# EAGLE design guhPLC_dimmModule_V0.1 (EAGLE 6.1)
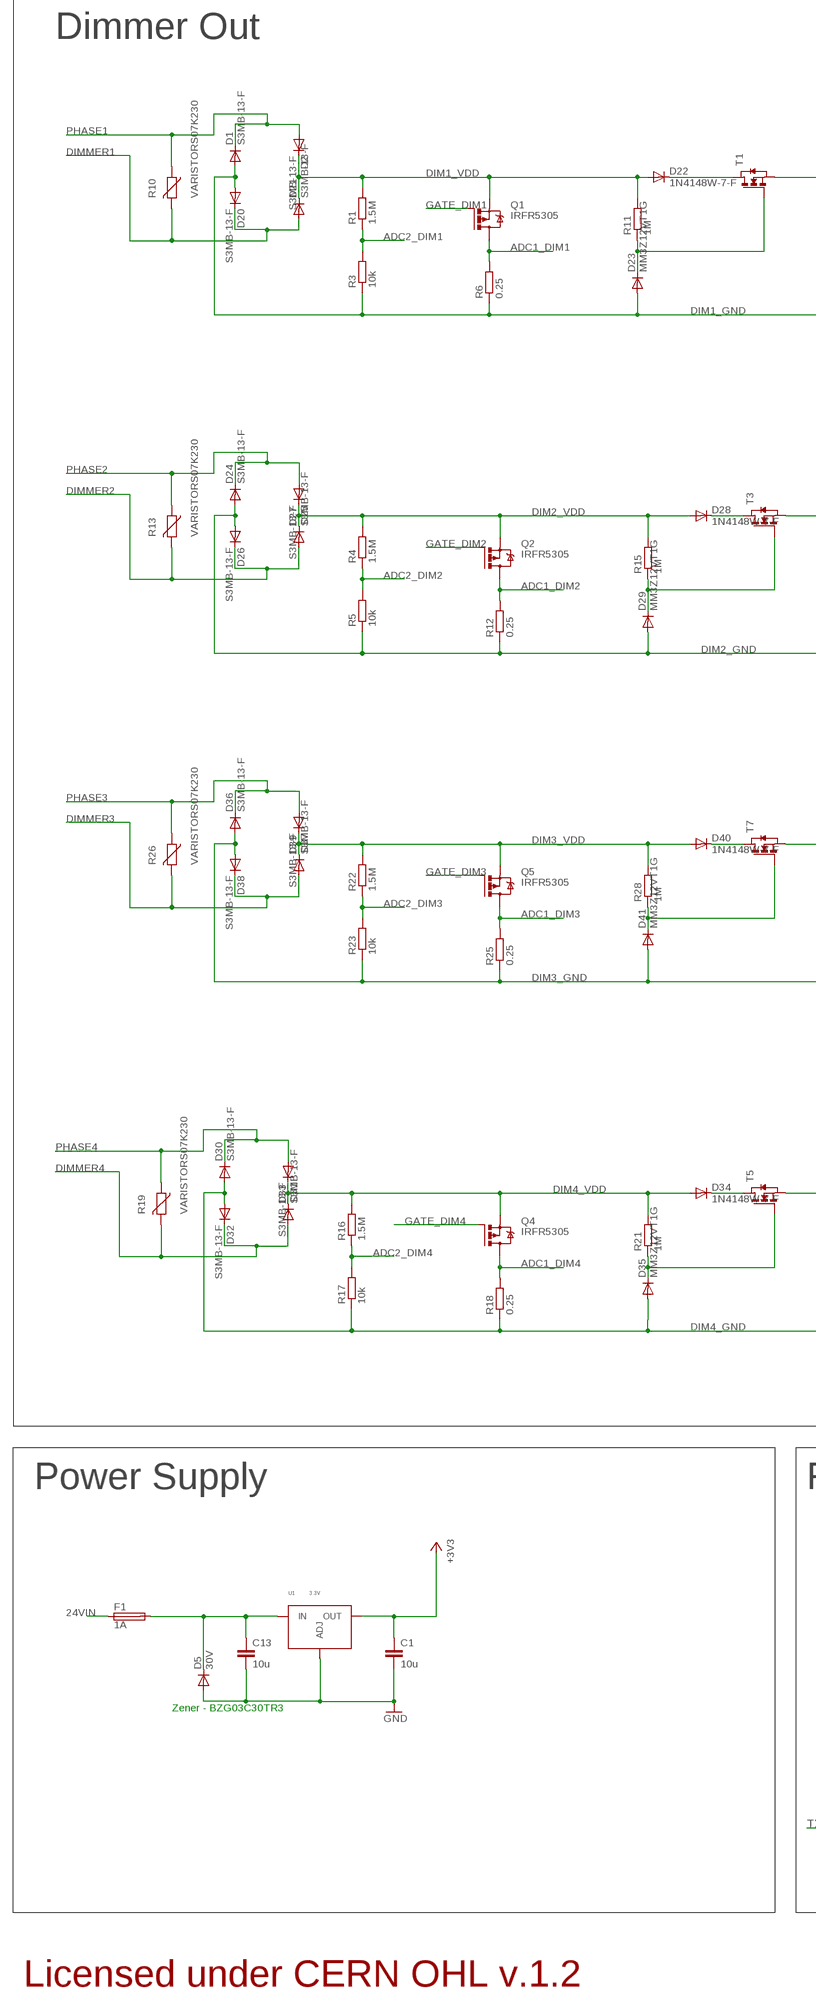
[diagram p0: schematic, sheet 1, part 1 of 2]
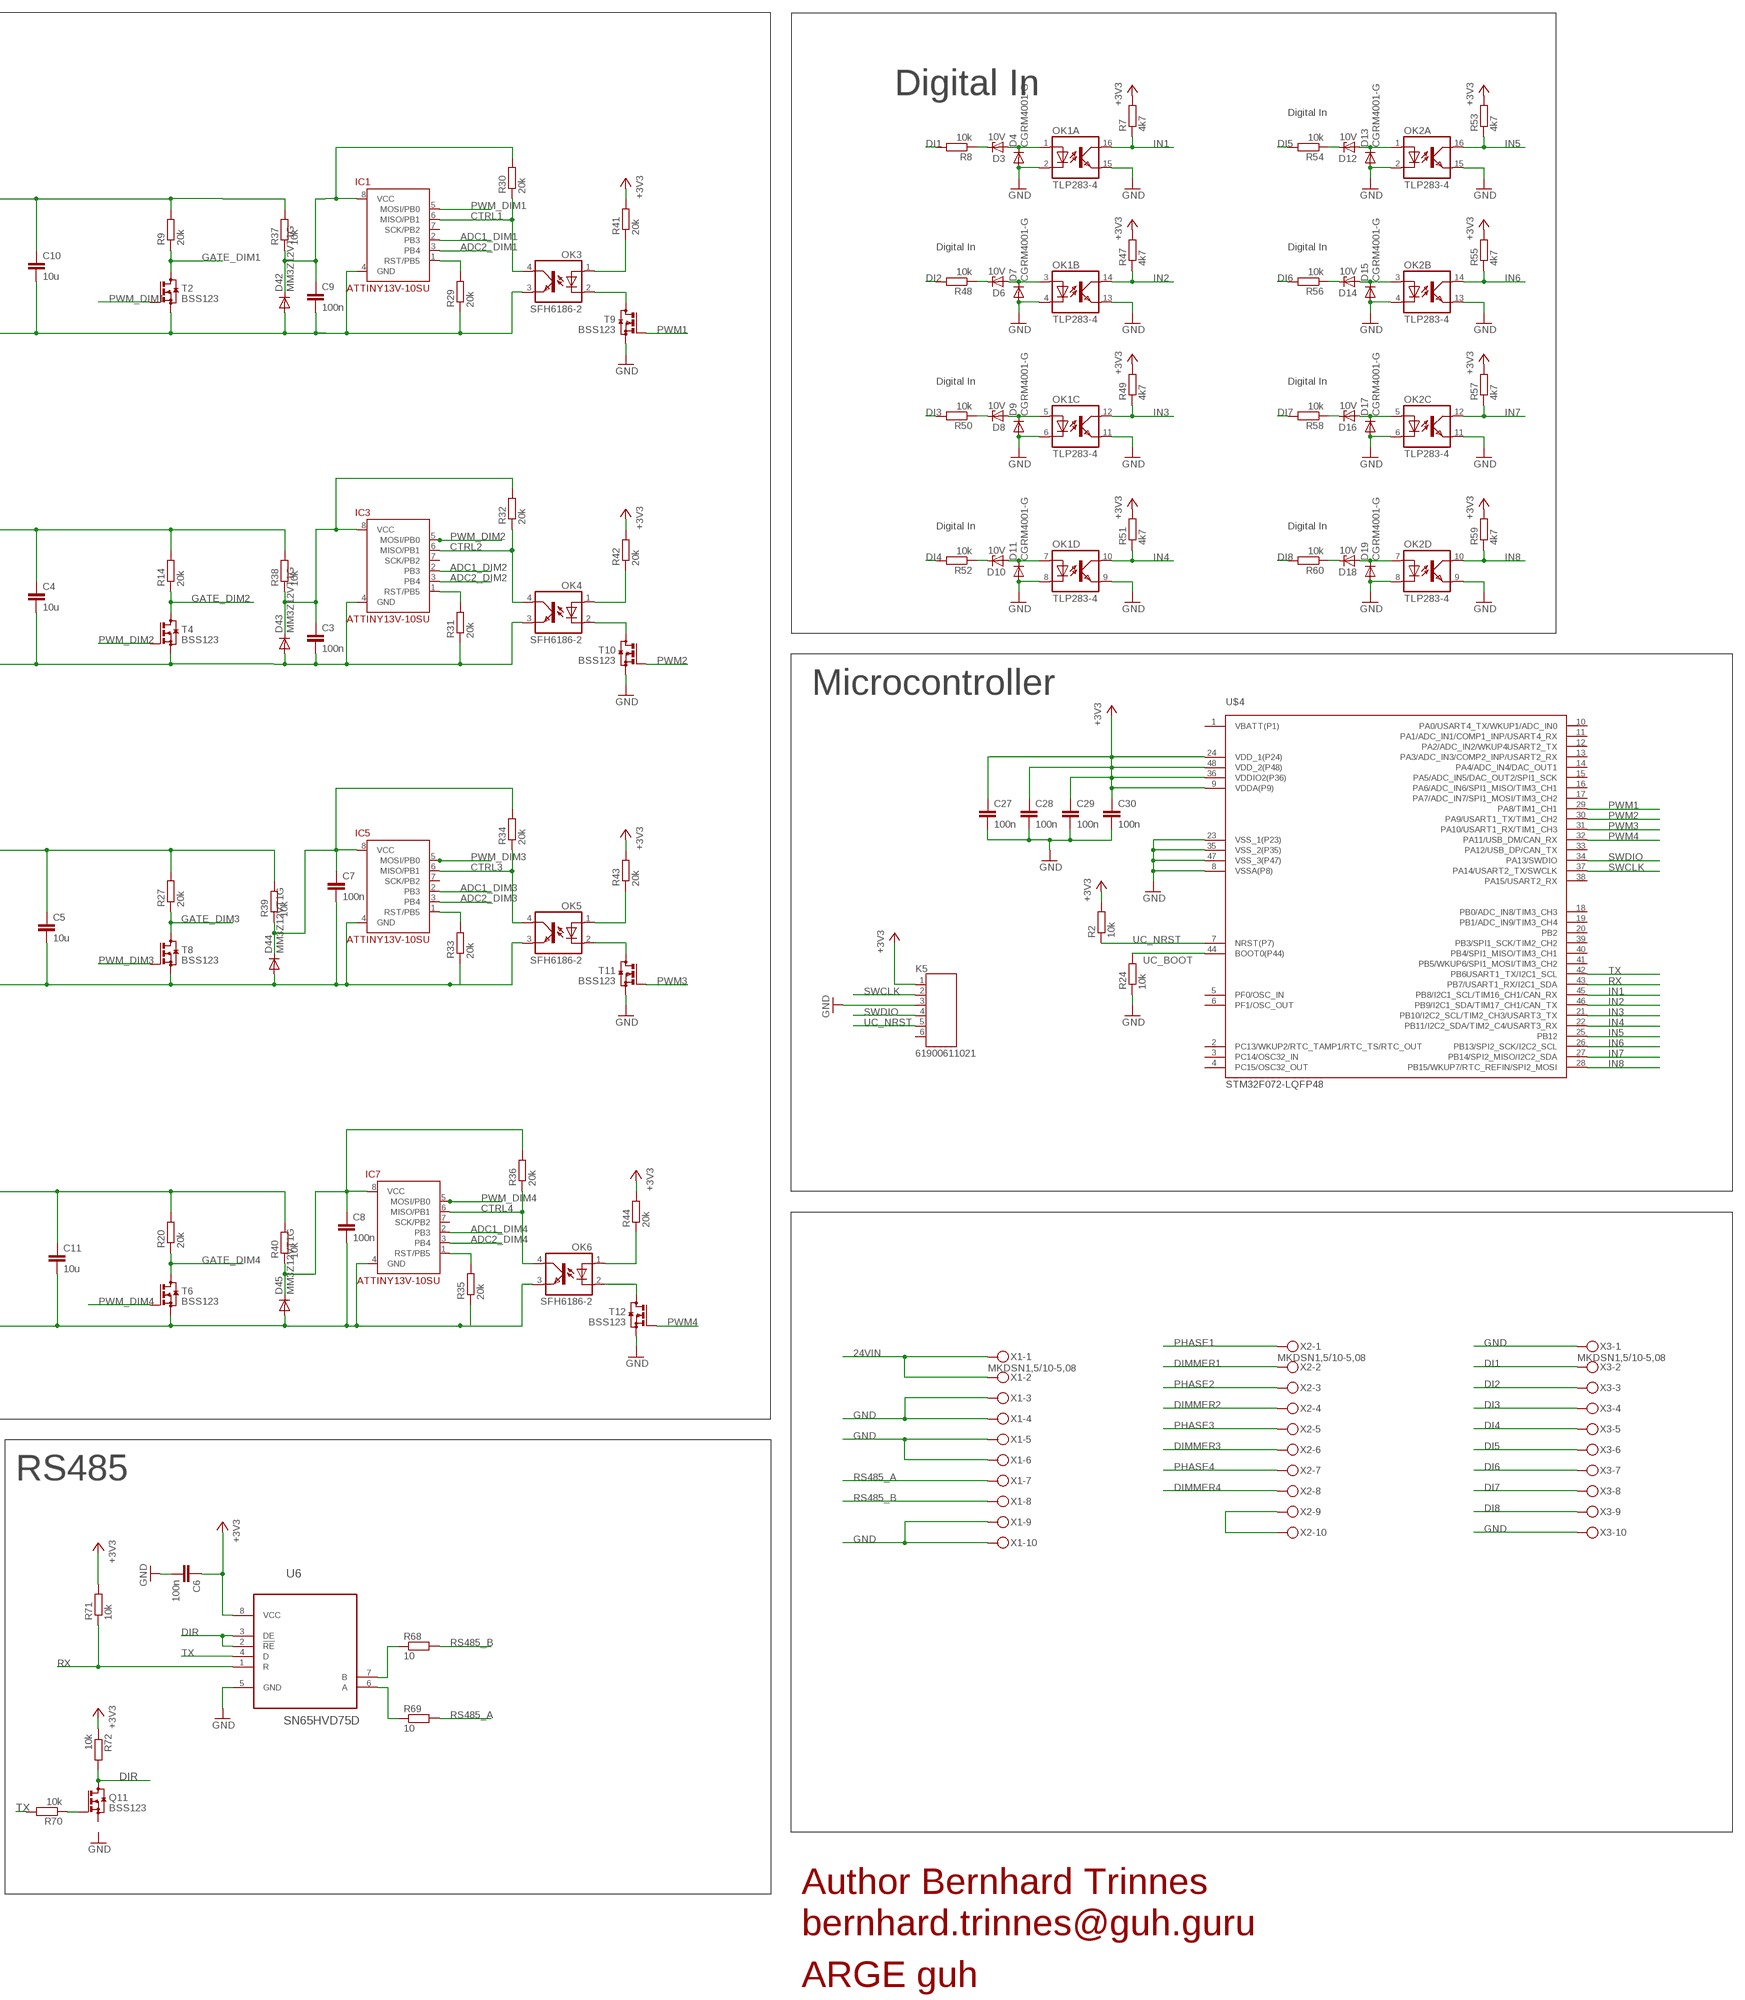
[diagram p1: schematic, sheet 1, part 2 of 2]

## Parts
C1  10u  C-EUC1206  [C1206]
C3  100n  C-EUC0603  [C0603]
C4  10u  C-EUC1206  [C1206]
C5  10u  C-EUC1206  [C1206]
C6  100n  C-EUC1206  [C1206]
C7  100n  C-EUC0603  [C0603]
C8  100n  C-EUC0603  [C0603]
C9  100n  C-EUC0603  [C0603]
C10  10u  C-EUC1206  [C1206]
C11  10u  C-EUC1206  [C1206]
C13  10u  C-EUC1206  [C1206]
C27  100n  C-EUC0603  [C0603]
C28  100n  C-EUC0603  [C0603]
C29  100n  C-EUC0603  [C0603]
C30  100n  C-EUC0603  [C0603]
D1  S3MB-13-F  DIODE-DO214AA  [DO214AA]
D2  S3MB-13-F  DIODE-DO214AA  [DO214AA]
D3  10V  ZENER-DIODESOD80C  [SOD80C]
D4  CGRM4001-G  [SOD-123_MINI-SMA]
D5  30V  DIODE-DO214AC  [DO214AC]
D6  10V  ZENER-DIODESOD80C  [SOD80C]
D7  CGRM4001-G  [SOD-123_MINI-SMA]
D8  10V  ZENER-DIODESOD80C  [SOD80C]
D9  CGRM4001-G  [SOD-123_MINI-SMA]
D10  10V  ZENER-DIODESOD80C  [SOD80C]
D11  CGRM4001-G  [SOD-123_MINI-SMA]
D12  10V  ZENER-DIODESOD80C  [SOD80C]
D13  CGRM4001-G  [SOD-123_MINI-SMA]
D14  10V  ZENER-DIODESOD80C  [SOD80C]
D15  CGRM4001-G  [SOD-123_MINI-SMA]
D16  10V  ZENER-DIODESOD80C  [SOD80C]
D17  CGRM4001-G  [SOD-123_MINI-SMA]
D18  10V  ZENER-DIODESOD80C  [SOD80C]
D19  CGRM4001-G  [SOD-123_MINI-SMA]
D20  S3MB-13-F  DIODE-DO214AA  [DO214AA]
D21  S3MB-13-F  DIODE-DO214AA  [DO214AA]
D22  1N4148W-7-F  DIODE-SOD123  [SOD123]
D23  MM3Z12VT1G  DIODE-SOD323-W  [SOD323-W]
D24  S3MB-13-F  DIODE-DO214AA  [DO214AA]
D25  S3MB-13-F  DIODE-DO214AA  [DO214AA]
D26  S3MB-13-F  DIODE-DO214AA  [DO214AA]
D27  S3MB-13-F  DIODE-DO214AA  [DO214AA]
D28  1N4148W-7-F  DIODE-SOD123  [SOD123]
D29  MM3Z12VT1G  DIODE-SOD323-W  [SOD323-W]
D30  S3MB-13-F  DIODE-DO214AA  [DO214AA]
D31  S3MB-13-F  DIODE-DO214AA  [DO214AA]
D32  S3MB-13-F  DIODE-DO214AA  [DO214AA]
D33  S3MB-13-F  DIODE-DO214AA  [DO214AA]
D34  1N4148W-7-F  DIODE-SOD123  [SOD123]
D35  MM3Z12VT1G  DIODE-SOD323-W  [SOD323-W]
D36  S3MB-13-F  DIODE-DO214AA  [DO214AA]
D37  S3MB-13-F  DIODE-DO214AA  [DO214AA]
D38  S3MB-13-F  DIODE-DO214AA  [DO214AA]
D39  S3MB-13-F  DIODE-DO214AA  [DO214AA]
D40  1N4148W-7-F  DIODE-SOD123  [SOD123]
D41  MM3Z12VT1G  DIODE-SOD323-W  [SOD323-W]
D42  MM3Z12VT1G  DIODE-SOD323-W  [SOD323-W]
D43  MM3Z12VT1G  DIODE-SOD323-W  [SOD323-W]
D44  MM3Z12VT1G  DIODE-SOD323-W  [SOD323-W]
D45  MM3Z12VT1G  DIODE-SOD323-W  [SOD323-W]
F1  1A  LITTLEFUSE  [LITTLEFUSE]
IC1  ATTINY13V-10SU  [SOIC8]
IC3  ATTINY13V-10SU  [SOIC8]
IC5  ATTINY13V-10SU  [SOIC8]
IC7  ATTINY13V-10SU  [SOIC8]
K5  61900611021  [61900611021]
OK1  TLP283-4  [MINI-FLAT-16]
OK2  TLP283-4  [MINI-FLAT-16]
OK3  SFH6186-2  [SMD4]
OK4  SFH6186-2  [SMD4]
OK5  SFH6186-2  [SMD4]
OK6  SFH6186-2  [SMD4]
Q1  IRFR5305  [D-PAK_TO252AA]
Q2  IRFR5305  [D-PAK_TO252AA]
Q4  IRFR5305  [D-PAK_TO252AA]
Q5  IRFR5305  [D-PAK_TO252AA]
Q11  BSS123  [SOT23]
R1  1.5M  R-EU_R1206  [R1206]
R2  10k  R-EU_R0603  [R0603]
R3  10k  R-EU_R1206  [R1206]
R4  1.5M  R-EU_M1206  [M1206]
R5  10k  R-EU_M1206  [M1206]
R6  0.25  R-EU_R1206  [R1206]
R7  4k7  R-EU_R0603  [R0603]
R8  10k  R-EU_R0805  [R0805]
R9  20k  R-EU_M1206  [M1206]
R10  VARISTORS07K230  [S07K230]
R11  1M  R-EU_R1206  [R1206]
R12  0.25  R-EU_M1206  [M1206]
R13  VARISTORS07K230  [S07K230]
R14  20k  R-EU_M1206  [M1206]
R15  1M  R-EU_M1206  [M1206]
R16  1.5M  R-EU_M1206  [M1206]
R17  10k  R-EU_M1206  [M1206]
R18  0.25  R-EU_M1206  [M1206]
R19  VARISTORS07K230  [S07K230]
R20  20k  R-EU_M1206  [M1206]
R21  1M  R-EU_M1206  [M1206]
R22  1.5M  R-EU_M1206  [M1206]
R23  10k  R-EU_M1206  [M1206]
R24  10k  R-EU_R0603  [R0603]
R25  0.25  R-EU_M1206  [M1206]
R26  VARISTORS07K230  [S07K230]
R27  20k  R-EU_M1206  [M1206]
R28  1M  R-EU_M1206  [M1206]
R29  20k  R-EU_R0603  [R0603]
R30  20k  R-EU_R0603  [R0603]
R31  20k  R-EU_R0603  [R0603]
R32  20k  R-EU_R0603  [R0603]
R33  20k  R-EU_R0603  [R0603]
R34  20k  R-EU_R0603  [R0603]
R35  20k  R-EU_R0603  [R0603]
R36  20k  R-EU_R0603  [R0603]
R37  10k  R-EU_M1206  [M1206]
R38  10k  R-EU_M1206  [M1206]
R39  10k  R-EU_M1206  [M1206]
R40  10k  R-EU_M1206  [M1206]
R41  20k  R-EU_R0603  [R0603]
R42  20k  R-EU_R0603  [R0603]
R43  20k  R-EU_R0603  [R0603]
R44  20k  R-EU_R0603  [R0603]
R47  4k7  R-EU_R0603  [R0603]
R48  10k  R-EU_R0805  [R0805]
R49  4k7  R-EU_R0603  [R0603]
R50  10k  R-EU_R0805  [R0805]
R51  4k7  R-EU_R0603  [R0603]
R52  10k  R-EU_R0805  [R0805]
R53  4k7  R-EU_R0603  [R0603]
R54  10k  R-EU_R0805  [R0805]
R55  4k7  R-EU_R0603  [R0603]
R56  10k  R-EU_R0805  [R0805]
R57  4k7  R-EU_R0603  [R0603]
R58  10k  R-EU_R0805  [R0805]
R59  4k7  R-EU_R0603  [R0603]
R60  10k  R-EU_R0805  [R0805]
R68  10  R-EU_R0603  [R0603]
R69  10  R-EU_R0603  [R0603]
R70  10k  R-EU_R0603  [R0603]
R71  10k  R-EU_R0603  [R0603]
R72  10k  R-EU_R0603  [R0603]
T1  NMOSSOT23  [SOT-23]
T2  BSS123  [SOT23]
T3  NMOSSOT23  [SOT-23]
T4  BSS123  [SOT23]
T5  NMOSSOT23  [SOT-23]
T6  BSS123  [SOT23]
T7  NMOSSOT23  [SOT-23]
T8  BSS123  [SOT23]
T9  BSS123  [SOT23]
T10  BSS123  [SOT23]
T11  BSS123  [SOT23]
T12  BSS123  [SOT23]
U1  3.3V  ADJ_VOLTAGE_REGTO-252-3L  [TO-252-3L]
U6  SN65HVD75D  [SOIC127P600X175-8N]
U$4  STM32F072-LQFP48  [LQFP48]
X1  MKDSN1,5/10-5,08  [MKDSN1,5/10-5,08]
X2  MKDSN1,5/10-5,08  [MKDSN1,5/10-5,08]
X3  MKDSN1,5/10-5,08  [MKDSN1,5/10-5,08]

## Nets
24VIN: F1.1 X1.1 X1.2
+3V3: C1.1 C6.1 C27.1 C28.1 C29.1 C30.1 K5.1 R2.2 R7.2 R41.2 R42.2 R43.2 R44.2 R47.2 R49.2 R51.2 R53.2 R55.2 R57.2 R59.2 R71.2 R72.1 U1.PAD(OUT) U6.8(VCC) U$4.9(VDDA(P9)) U$4.24(VDD_1(P24)) U$4.36(VDDIO2(P36)) U$4.48(VDD_2(P48))
ADC1_DIM1: IC1.2(PB3) Q1.4(D) R6.2
ADC1_DIM2: IC3.2(PB3) Q2.4(D) R12.2
ADC1_DIM3: IC5.2(PB3) Q5.4(D) R25.2
ADC1_DIM4: IC7.2(PB3) Q4.4(D) R18.2
ADC2_DIM1: IC1.3(PB4) R1.1 R3.2
ADC2_DIM2: IC3.3(PB4) R4.1 R5.2
ADC2_DIM3: IC5.3(PB4) R22.1 R23.2
ADC2_DIM4: IC7.3(PB4) R16.1 R17.2
CTRL1: IC1.6(MISO/PB1) OK3.4(COL) R30.1
CTRL2: IC3.6(MISO/PB1) OK4.4(COL) R32.1
CTRL3: IC5.6(MISO/PB1) OK5.4(COL) R34.1
CTRL4: IC7.6(MISO/PB1) OK6.4(COL) R36.1
DI1: R8.2 X3.2
DI2: R48.2 X3.3
DI3: R50.2 X3.4
DI4: R52.2 X3.5
DI5: R54.2 X3.6
DI6: R56.2 X3.7
DI7: R58.2 X3.8
DI8: R60.2 X3.9
DIM1_GND [gnd]: C9.2 C10.2 D1.A D20.A D23.A D42.A IC1.4(GND) OK3.3(EMIT) R3.1 R6.1 R29.1 T2.2(S)
DIM1_VDD: D2.C D21.C D22.A Q1.3(S) R1.2 R11.2
DIM2_GND [gnd]: C3.2 C4.2 D24.A D26.A D29.A D43.A IC3.4(GND) OK4.3(EMIT) R5.1 R12.1 R31.1 T4.2(S)
DIM2_VDD: D25.C D27.C D28.A Q2.3(S) R4.2 R15.2
DIM3_GND [gnd]: C5.2 C7.2 D36.A D38.A D41.A D44.A IC5.4(GND) OK5.3(EMIT) R23.1 R25.1 R33.1 T8.2(S)
DIM3_VDD: D37.C D39.C D40.A Q5.3(S) R22.2 R28.2
DIM4_GND [gnd]: C8.2 C11.2 D30.A D32.A D35.A D45.A IC7.4(GND) OK6.3(EMIT) R17.1 R18.1 R35.1 T6.2(S)
DIM4_VDD: D31.C D33.C D34.A Q4.3(S) R16.2 R21.2
DIMMER1: D20.C D21.A R10.2 X2.2
DIMMER2: D26.C D27.A R13.2 X2.4
DIMMER3: D38.C D39.A R26.2 X2.6
DIMMER4: D32.C D33.A R19.2 X2.8
DIR: Q11.3(D) R72.2 U6.2(!RE) U6.3(DE)
GATE_DIM1: Q1.1(G) R9.1 T2.3(D)
GATE_DIM2: Q2.1(G) R14.1 T4.3(D)
GATE_DIM3: Q5.1(G) R27.1 T8.3(D)
GATE_DIM4: Q4.1(G) R20.1 T6.3(D)
GND [gnd]: C1.2 C6.2 C13.2 C27.2 C28.2 C29.2 C30.2 D4.A D5.A D7.A D9.A D11.A D13.A D15.A D17.A D19.A K5.3 OK1.2(A:C) OK1.4(B:C) OK1.6(C:C) OK1.8(D:C) OK1.9(D:EMIT) OK1.11(C:EMIT) OK1.13(B:EMIT) OK1.15(A:EMIT) OK2.2(A:C) OK2.4(B:C) OK2.6(C:C) OK2.8(D:C) OK2.9(D:EMIT) OK2.11(C:EMIT) OK2.13(B:EMIT) OK2.15(A:EMIT) R24.1 T9.2(S) T10.2(S) T11.2(S) T12.2(S) U1.1(ADJ) U6.5(GND) U$4.8(VSSA(P8)) U$4.23(VSS_1(P23)) U$4.35(VSS_2(P35)) U$4.47(VSS_3(P47)) X1.3 X1.4 X1.5 X1.6 X1.9 X1.10 X3.1 X3.10
IN1: OK1.16(A:COL) R7.1 U$4.45(PB8/I2C1_SCL/TIM16_CH1/CAN_RX)
IN2: OK1.14(B:COL) R47.1 U$4.46(PB9/I2C1_SDA/TIM17_CH1/CAN_TX)
IN3: OK1.12(C:COL) R49.1 U$4.21(PB10/I2C2_SCL/TIM2_CH3/USART3_TX)
IN4: OK1.10(D:COL) R51.1 U$4.22(PB11/I2C2_SDA/TIM2_C4/USART3_RX)
IN5: OK2.16(A:COL) R53.1 U$4.25(PB12)
IN6: OK2.14(B:COL) R55.1 U$4.26(PB13/SPI2_SCK/I2C2_SCL)
IN7: OK2.12(C:COL) R57.1 U$4.27(PB14/SPI2_MISO/I2C2_SDA)
IN8: OK2.10(D:COL) R59.1 U$4.28(PB15/WKUP7/RTC_REFIN/SPI2_MOSI)
N$1 [power]: C8.1 D45.C IC7.8(VCC) R36.2 R40.1
N$2: D29.C R15.1 T3.3(G)
N$3: D28.C T3.1(D)
N$4: D22.C T1.1(D)
N$5: D23.C R11.1 T1.3(G)
N$6 [power]: C9.1 D42.C IC1.8(VCC) R30.2 R37.1
N$7 [power]: C3.1 D43.C IC3.8(VCC) R32.2 R38.1
N$8: D3.C R8.1
N$9: D35.C R21.1 T5.3(G)
N$10: D3.A D4.C OK1.1(A:A)
N$11: D34.C T5.1(D)
N$12 [power]: C7.1 D44.C IC5.8(VCC) R34.2 R39.1
N$13: D41.C R28.1 T7.3(G)
N$14: D40.C T7.1(D)
N$15: C10.1 R9.2 R37.2 T1.2(S)
N$16: OK3.1(A) R41.1
N$17: C4.1 R14.2 R38.2 T3.2(S)
N$18: OK3.2(C) T9.3(D)
N$19: OK4.1(A) R42.1
N$20: C5.1 R27.2 R39.2 T7.2(S)
N$21: D6.C R48.1
N$22: OK4.2(C) T10.3(D)
N$23: D6.A D7.C OK1.3(B:A)
N$24: OK5.1(A) R43.1
N$25: C11.1 R20.2 R40.2 T5.2(S)
N$26: IC5.1(RST/PB5) R33.2
N$27: OK5.2(C) T11.3(D)
N$28: OK6.1(A) R44.1
N$29: OK6.2(C) T12.3(D)
N$30: X2.9 X2.10
N$33: IC1.1(RST/PB5) R29.2
N$34: IC3.1(RST/PB5) R31.2
N$35: IC7.1(RST/PB5) R35.2
N$38: D8.C R50.1
N$39: D8.A D9.C OK1.5(C:A)
N$40: D10.C R52.1
N$41: D10.A D11.C OK1.7(D:A)
N$42: D12.C R54.1
N$45: D12.A D13.C OK2.1(A:A)
N$47: D14.C R56.1
N$49: D14.A D15.C OK2.3(B:A)
N$51: D16.C R58.1
N$53: D16.A D17.C OK2.5(C:A)
N$54: D18.C R60.1
N$55: D18.A D19.C OK2.7(D:A)
N$63: R68.1 U6.7(B)
N$64: R69.1 U6.6(A)
N$65: Q11.1(G) R70.1
PHASE1: D1.C D2.A R10.1 X2.1
PHASE2: D24.C D25.A R13.1 X2.3
PHASE3: D36.C D37.A R26.1 X2.5
PHASE4: D30.C D31.A R19.1 X2.7
PWM1: T9.1(G) U$4.29(PA8/TIM1_CH1)
PWM2: T10.1(G) U$4.30(PA9/USART1_TX/TIM1_CH2)
PWM3: T11.1(G) U$4.31(PA10/USART1_RX/TIM1_CH3)
PWM4: T12.1(G) U$4.32(PA11/USB_DM/CAN_RX)
PWM_DIM1: IC1.5(MOSI/PB0) T2.1(G)
PWM_DIM2: IC3.5(MOSI/PB0) T4.1(G)
PWM_DIM3: IC5.5(MOSI/PB0) T8.1(G)
PWM_DIM4: IC7.5(MOSI/PB0) T6.1(G)
RS485_A: R69.2 X1.7
RS485_B: R68.2 X1.8
RX: R71.1 U6.1(R) U$4.43(PB7/USART1_RX/I2C1_SDA)
SWCLK: K5.2 U$4.37(PA14/USART2_TX/SWCLK)
SWDIO: K5.4 U$4.34(PA13/SWDIO)
TX: R70.2 U6.4(D) U$4.42(PB6USART1_TX/I2C1_SCL)
UC_BOOT: R24.2 U$4.44(BOOT0(P44))
UC_NRST: K5.5 R2.1 U$4.7(NRST(P7))
VCC [power]: C13.1 D5.C F1.2 U1.2(IN)
Unconnected: IC1.7(SCK/PB2) IC3.7(SCK/PB2) IC5.7(SCK/PB2) IC7.7(SCK/PB2) K5.6 Q11.2(S) U$4.1(VBATT(P1)) U$4.2(PC13/WKUP2/RTC_TAMP1/RTC_TS/RTC_OUT) U$4.3(PC14/OSC32_IN) U$4.4(PC15/OSC32_OUT) U$4.5(PF0/OSC_IN) U$4.6(PF1/OSC_OUT) U$4.10(PA0/USART4_TX/WKUP1/ADC_IN0) U$4.11(PA1/ADC_IN1/COMP1_INP/USART4_RX) U$4.12(PA2/ADC_IN2/WKUP4USART2_TX) U$4.13(PA3/ADC_IN3/COMP2_INP/USART2_RX) U$4.14(PA4/ADC_IN4/DAC_OUT1) U$4.15(PA5/ADC_IN5/DAC_OUT2/SPI1_SCK) U$4.16(PA6/ADC_IN6/SPI1_MISO/TIM3_CH1) U$4.17(PA7/ADC_IN7/SPI1_MOSI/TIM3_CH2) U$4.18(PB0/ADC_IN8/TIM3_CH3) U$4.19(PB1/ADC_IN9/TIM3_CH4) U$4.20(PB2) U$4.33(PA12/USB_DP/CAN_TX) U$4.38(PA15/USART2_RX) U$4.39(PB3/SPI1_SCK/TIM2_CH2) U$4.40(PB4/SPI1_MISO/TIM3_CH1) U$4.41(PB5/WKUP6/SPI1_MOSI/TIM3_CH2)

## Notes on the sheet
- Dimmer Out
- Digital In
- Digital In
- Digital In | Digital In
- Digital In | Digital In
- Digital In | Digital In
- Microcontroller
- Power Supply | RS485
- Zener - BZG03C30TR3
- Author Bernhard Trinnes
- bernhard.trinnes@guh.guru
- Licensed under CERN OHL v.1.2
- ARGE guh

## Library data of the parts
C1 C3-C11 C13 C27-C30 = resistor:C-EU: CAPACITOR, European symbol
D1 D2 D5 D20-D28 D30-D34 D36-D40 D42-D45 = diode:DIODE-: DIODE
D3 D6 D8 D10 D12 D14 D16 D18 = diode:ZENER-DIODE: Z-Diode
D4 D7 D9 D11 D13 D15 D17 D19 = diode:CGRM400*-G: Molded plasitc,JEDEC SOD-123/Mini SMA Source: Comchip CGRM4001-G.pdf
D29 D35 D41 = guh:DIODE-: DIODE
F1 = fuse:LITTLEFUSE: LITTLEFUSE Picofuse/slow Littlefuse; OC_FARNELL: unknown; OC_NEWARK: unknown
IC1 IC3 IC5 IC7 = attiny13:ATTINY13V-10*
K5 = EagleLibrary_Wuerth_Elektronik _eiCan_Wire_to_Board_Connectors_v6_20150113:61900611021: WR-WTB Wire-to-Board Connectors 2.54 mm - 6 Pins;=>Code : _61900611021 <http://katalog.we-online.de/media/images/eican/> Details see: http://katalog.we-online.de/em/datasheet/6190xx11021.pdf Created 11/27/2014, Karrer Zheng 2014 (C) Wurth Elektronik
OK1 OK2 = optocoupler:TLP283-4: TOSHIBA PHOTOCOUPLER GaAs IRED & PHOTO-TRANSISTOR Source: http://www.semicon.toshiba.co.jp/td/en/Opto/Photocoupler/en_20050928_TLP283_datasheet.pdf; OC_FARNELL: unknown; OC_NEWARK: unknown
OK3-OK6 = optocoupler:SFH618?*: Optocoupler, Phototransistor Output, Low Input Current Source: http://www.vishay.com/docs/83673/sfh618.pdf; MF: VISHAY/TELEFUNKEN; MPN: SFH6186-2; OC_FARNELL: 1469583; OC_NEWARK: 58K2210
Q1 Q2 Q4 Q5 = transistor-power:IRF?5305: HEXFET Power MOSFET Source: http://www.irf.com/product-info/datasheets/data/irfr5305pbf.pdf
Q11 T2 T4 T6 T8-T12 = transistor-small-signal:BSS123: N-CHANNEL MOS FET
R1-R9 R11 R12 R14-R18 R20-R25 R27-R44 R47-R60 R68-R72 = resistor:R-EU_: RESISTOR, European symbol
R10 R13 R19 R26 = varistor:VARISTOR: VARISTOR
T1 T3 T5 T7 = zetex:NMOSSOT23: MOS FET; OC_FARNELL: unknown; OC_NEWARK: unknown
U1 = PP_PowerIC:ADJ_VOLTAGE_REG
U6 = guh:SN65HVD75D: 3.3V-Supply RS-485 with IEC ESD Protection,SOIC-8; MPN: SN65HVD75D; OC_FARNELL: 2127163; OC_NEWARK: 94T1770; PACKAGE: SOIC- 8; SUPPLIER: TEXAS INSTRUMENTS
U$4 = stm32f0:STM32F072
X1-X3 = con-phoenix-508:MKDSN1,5/10-5,08: MKDSN 1,5/10-5,08 Printklemme Nennstrom: 13,5 A Nennspannung: 250 V Rastermaß: 5,08 mm Polzahl: 10 Anschlussart: Schraubanschluss Montage: Löten Anschlussrichtung Leiter/Platine: 0 ° Artikelnummer: 1729209 Source: http://eshop.phoenixcontact.com .. 1729209.pdf; MPN: SMKDSN1,5/10-5,08; OC_FARNELL: 1792913; OC_NEWARK: 70R0297

## Net classes
1 power: width 0.61 mm, drill 0.61 mm, clearance 0.254 mm
2 gnd: width 0.305 mm, drill 0.559 mm, clearance 0.254 mm

## Board
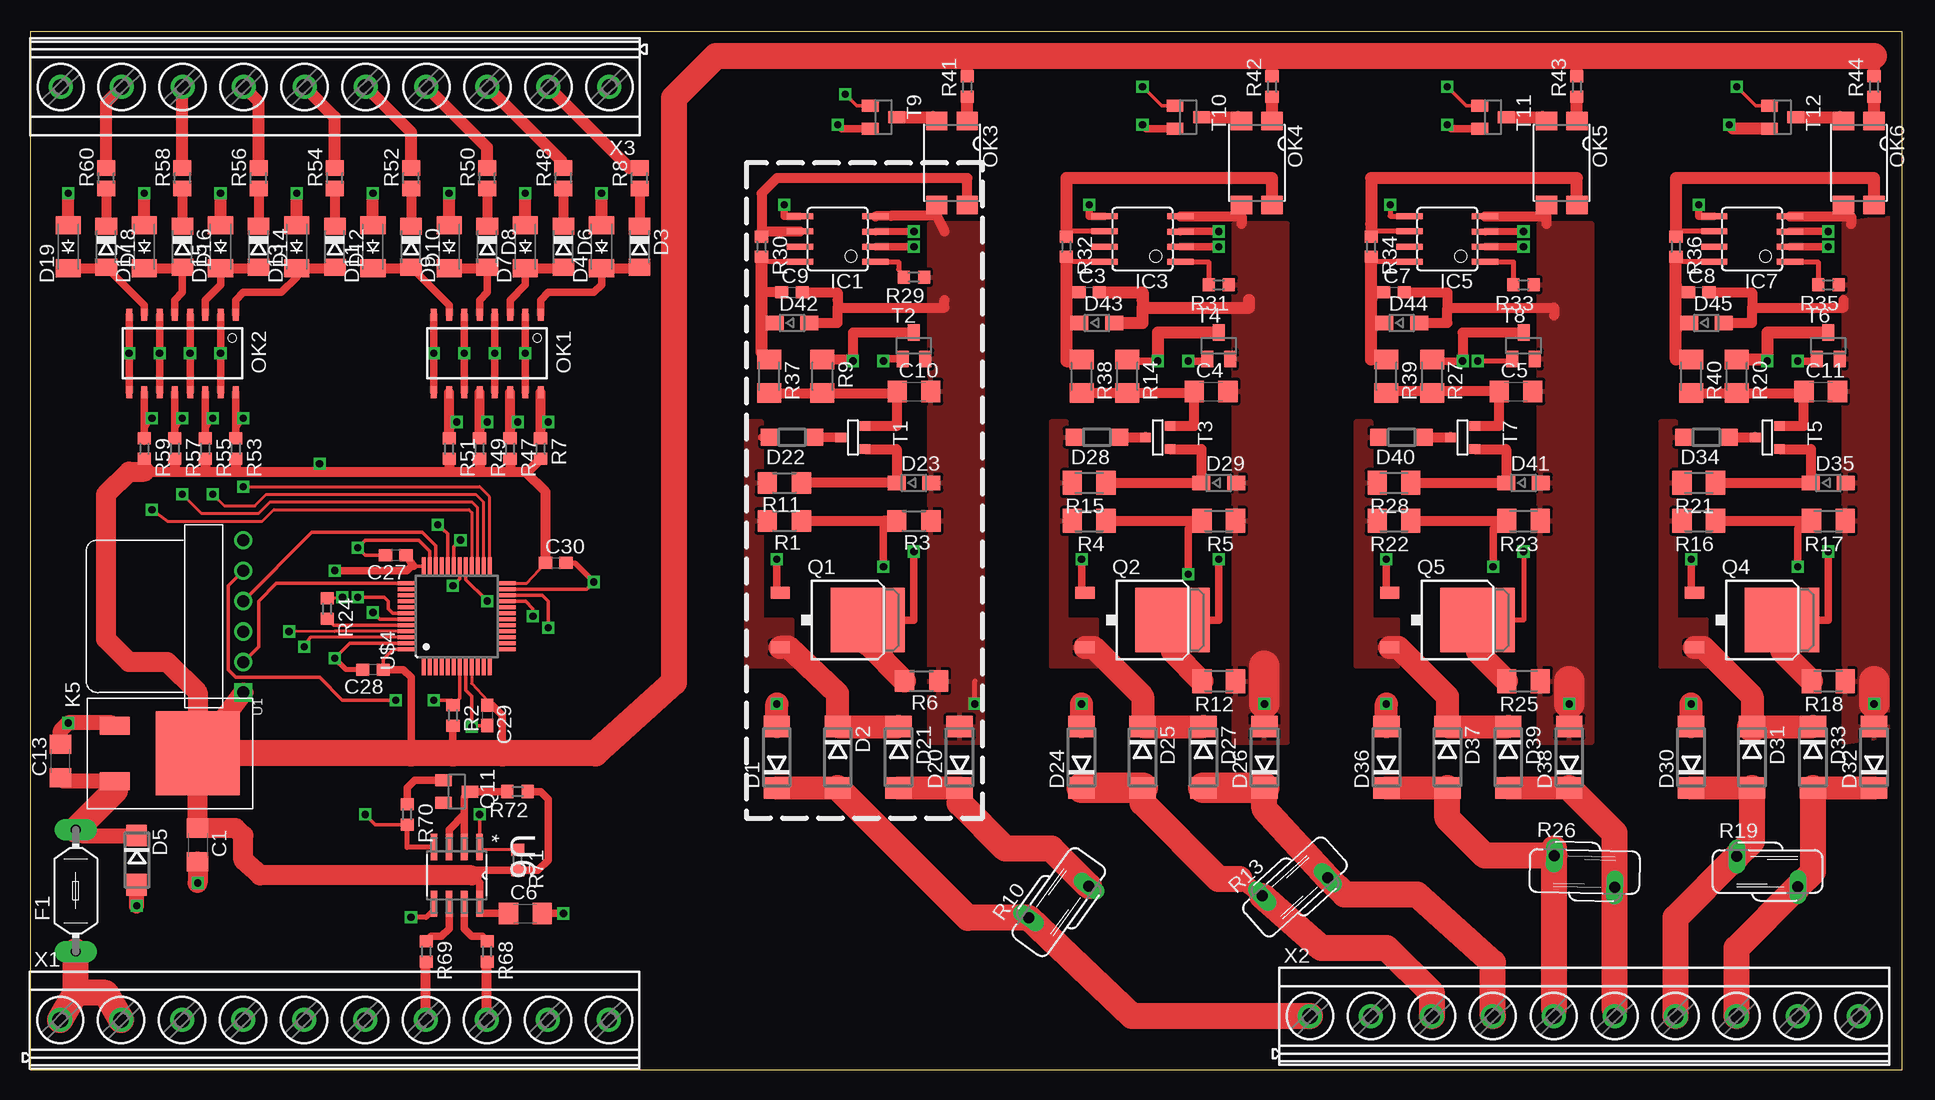
[diagram p2: board, top side]
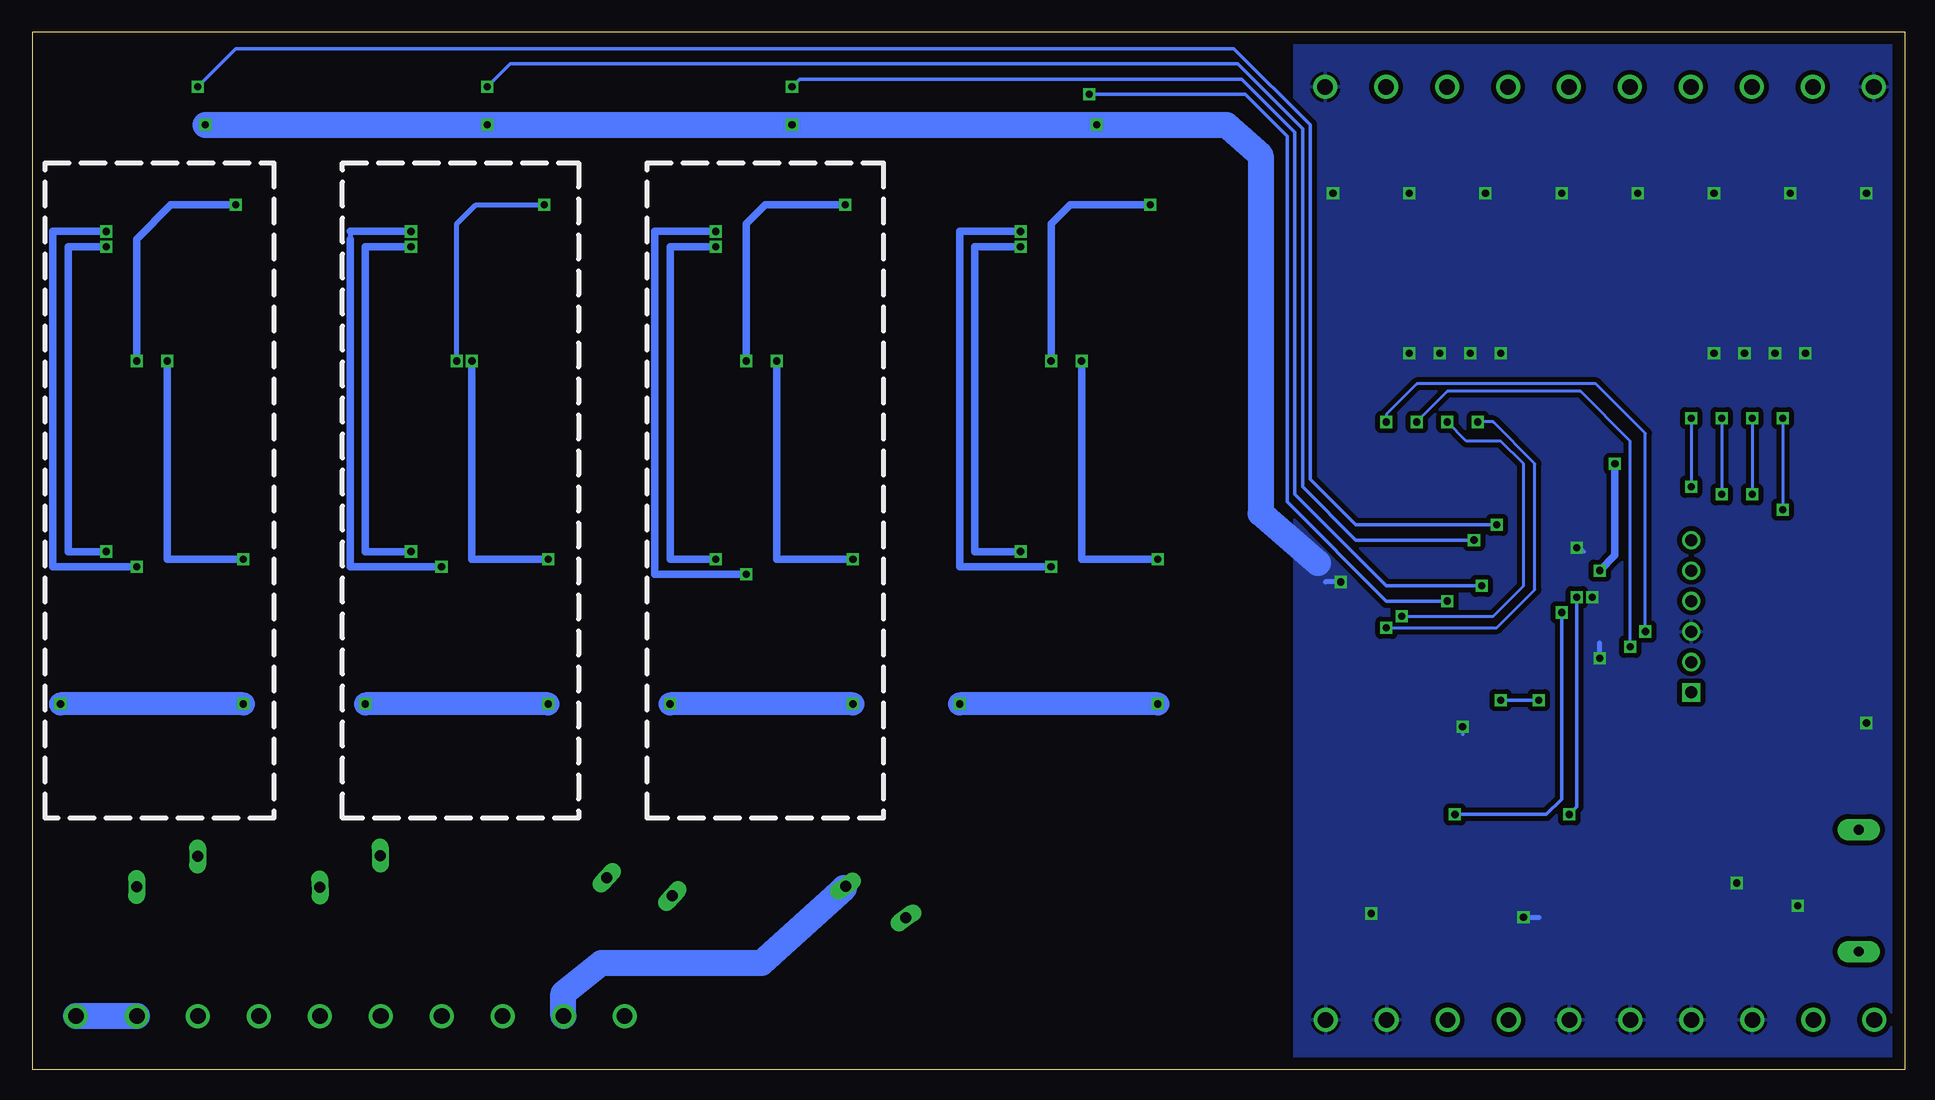
[diagram p3: board, bottom side, seen from below]

Size 156 x 86.5 mm. Coordinates in mm from the lower left corner, seen from the top.
Outline: 0,0 156,0 156,86.5 0,86.5 0,0
Copper layers (1*16): Top 0.035mm / dielectric 1.5mm / Bottom 0.035mm
Design rules: minimum track width 10mil, minimum drill 24mil, track to track 8mil, track to pad 8mil, pad to pad 8mil, via to via 8mil, smd to smd 8mil, copper to edge 40mil, drill to drill 8mil, minimum pad ring 10mil, minimum via ring 8mil, stop-mask expansion 4mil, vias tented up to drill 0mil, thermal gap 10mil

### Footprints (pad centres in the part's own frame; a part is rotated, then mirrored left to right if it is on the bottom)
C1206 = smd 1.6 x 1.8: 1 -1.4,0; 2 1.4,0
C0603 = smd 1.1 x 1: 1 -0.85,0; 2 0.85,0
DO214AA = smd 1.8 x 2.2: A 2.55,0; C -2.55,0
SOD80C = smd 1.4 x 1.8: A 1.7,0; C -1.7,0
SOD-123_MINI-SMA = smd 1.5 x 2.1: A 1.8,0; C -1.8,0
DO214AC = smd 1.8 x 1.7: A 2.05,0; C -2.05,0
SOD123 = smd 1.4 x 1.4: A 1.9,0; C -1.9,0
SOD323-W = smd 1.5 x 1.2: A 1.45,0; C -1.45,0
LITTLEFUSE = drill 0.813 pad 1.778 long: 1 -5.08,0; 2 5.08,0
SOIC8 = smd 0.5 x 2.2: 1 -1.905,-3.154; 2 -0.645,-3.154; 3 0.625,-3.154; 4 1.895,-3.154; 5 1.905,3.154; 6 0.635,3.154; 7 -0.635,3.154; 8 -1.905,3.154
61900611021 = drill 1 square: 1 -6.35,0 | drill 1: 2 -3.81,0; 3 -1.27,0; 4 1.27,0; 5 3.81,0; 6 6.35,0
MINI-FLAT-16 = smd 1 x 0.5: 1 -3.24,4.445; 2 -3.24,3.175; 3 -3.24,1.905; 4 -3.24,0.635; 5 -3.24,-0.635; 6 -3.24,-1.905; 7 -3.24,-3.175; 8 -3.24,-4.445; 9 3.24,-4.445; 10 3.24,-3.175; 11 3.24,-1.905; 12 3.24,-0.635; 13 3.24,0.635; 14 3.24,1.905; 15 3.24,3.175; 16 3.24,4.445
SMD4 = smd 1.78 x 1.55: 1 -1.27,-3.5; 2 1.27,-3.5; 3 1.27,3.5; 4 -1.27,3.5
D-PAK_TO252AA = smd 1 x 1.6: 1 -2.28,-4.8; 3 2.28,-4.8 | smd 5.4 x 6.2: 4 0,2.5
SOT23 = smd 1 x 1.4: 1 -0.95,-1.1; 2 0.95,-1.1; 3 0,1.1
R1206 = smd 1.6 x 1.803: 1 -1.422,0; 2 1.422,0
R0603 = smd 1 x 1.1: 1 -0.85,0; 2 0.85,0
M1206 = smd 1.6 x 2: 1 -1.4,0; 2 1.4,0
R0805 = smd 1.3 x 1.5: 1 -0.85,0; 2 0.85,0
S07K230 = drill 0.914 long: 1 -1.27,-2.54; 2 1.27,2.54
SOT-23 = smd 0.787 x 0.889: 1 0.025,-1.016; 2 -0.94,1.016; 3 0.991,1.016
TO-252-3L = smd 1.5 x 2.5: 1 -2.3,-6.9; 2 2.3,-6.9 | smd 7 x 7: PAD 0,0
SOIC127P600X175-8N = smd 2.184 x 0.559: 1 -2.362,1.905; 2 -2.362,0.635; 3 -2.362,-0.635; 4 -2.362,-1.905; 5 2.362,-1.905; 6 2.362,-0.635; 7 2.362,0.635; 8 2.362,1.905
LQFP48 = smd 1.5 x 0.3: 1 -4.15,2.75; 2 -4.15,2.25; 3 -4.15,1.75; 4 -4.15,1.25; 5 -4.15,0.75; 6 -4.15,0.25; 7 -4.15,-0.25; 8 -4.15,-0.75; 9 -4.15,-1.25; 10 -4.15,-1.75; 11 -4.15,-2.25; 12 -4.15,-2.75; 25 4.15,-2.75; 26 4.15,-2.25; 27 4.15,-1.75; 28 4.15,-1.25; 29 4.15,-0.75; 30 4.15,-0.25; 31 4.15,0.25; 32 4.15,0.75; 33 4.15,1.25; 34 4.15,1.75; 35 4.15,2.25; 36 4.15,2.75 | smd 0.3 x 1.5: 13 -2.75,-4.15; 14 -2.25,-4.15; 15 -1.75,-4.15; 16 -1.25,-4.15; 17 -0.75,-4.15; 18 -0.25,-4.15; 19 0.25,-4.15; 20 0.75,-4.15; 21 1.25,-4.15; 22 1.75,-4.15; 23 2.25,-4.15; 24 2.75,-4.15; 37 2.75,4.15; 38 2.25,4.15; 39 1.75,4.15; 40 1.25,4.15; 41 0.75,4.15; 42 0.25,4.15; 43 -0.25,4.15; 44 -0.75,4.15; 45 -1.25,4.15; 46 -1.75,4.15; 47 -2.25,4.15; 48 -2.75,4.15
MKDSN1,5/10-5,08 = drill 1.3 pad 2: 1 -22.881,0.025; 2 -17.801,0.025; 3 -12.721,0.025; 4 -7.641,0.025; 5 -2.561,0.025; 6 2.519,0.025; 7 7.599,0.025; 8 12.679,0.025; 9 17.759,0.025; 10 22.839,0.025

### Placement (x,y rotation side)
C1  13.97,18.73 270 top
C3  88.27,64.77 0 top
C4  98.42,56.52 0 top
C5  123.83,56.52 0 top
C6  41.27,13.02 0 top
C7  113.67,64.77 0 top
C8  139.06,64.77 0 top
C9  63.5,64.77 0 top
C10  73.66,56.52 0 top
C11  149.22,56.52 0 top
C13  2.54,25.72 90 top
C27  30.48,42.86 180 top
C28  28.57,33.34 180 top
C29  38.1,29.53 270 top
C30  43.81,42.23 0 top
D1  62.23,26.04 90 top
D2  67.31,26.04 270 top
D3  50.8,68.58 270 top
D4  47.62,68.58 90 top
D5  8.89,17.46 270 top
D6  44.45,68.58 270 top
D7  41.27,68.58 90 top
D8  38.1,68.58 270 top
D9  34.92,68.58 90 top
D10  31.75,68.58 270 top
D11  28.57,68.58 90 top
D12  25.4,68.58 270 top
D13  22.23,68.58 90 top
D14  19.05,68.58 270 top
D15  15.88,68.58 90 top
D16  12.7,68.58 270 top
D17  9.53,68.58 90 top
D18  6.35,68.58 270 top
D19  3.17,68.58 90 top
D20  77.47,26.04 90 top
D21  72.39,26.04 270 top
D22  63.5,52.7 180 top
D23  73.66,48.9 0 top
D24  87.63,26.04 90 top
D25  92.71,26.04 270 top
D26  102.87,26.04 90 top
D27  97.79,26.04 270 top
D28  88.9,52.7 180 top
D29  99.06,48.9 0 top
D30  138.43,26.04 90 top
D31  143.51,26.04 270 top
D32  153.67,26.04 90 top
D33  148.59,26.04 270 top
D34  139.7,52.7 180 top
D35  149.86,48.9 0 top
D36  113.03,26.04 90 top
D37  118.11,26.04 270 top
D38  128.27,26.04 90 top
D39  123.19,26.04 270 top
D40  114.3,52.7 180 top
D41  124.46,48.9 0 top
D42  63.5,62.23 0 top
D43  88.9,62.23 0 top
D44  114.3,62.23 0 top
D45  139.7,62.23 0 top
F1  3.81,14.92 90 top
IC1  67.31,69.22 90 top
IC3  92.71,69.22 90 top
IC5  118.11,69.22 90 top
IC7  143.51,69.22 90 top
K5  17.78,37.78 90 top
OK1  38.1,59.69 270 top
OK2  12.7,59.69 270 top
OK3  76.83,75.56 180 top
OK4  102.23,75.56 180 top
OK5  127.64,75.56 180 top
OK6  152.4,75.56 180 top
Q1  67.31,37.47 270 top
Q2  92.71,37.47 270 top
Q4  143.51,37.47 270 top
Q5  118.11,37.47 270 top
Q11  35.56,23.18 270 top
R1  62.87,45.73 180 top
R2  35.24,29.53 270 top
R3  73.66,45.73 180 top
R4  88.27,45.73 180 top
R5  99.06,45.73 180 top
R6  74.3,32.38 180 top
R7  42.55,51.75 270 top
R8  50.8,74.3 90 top
R9  66.04,57.78 270 top
R10  85.72,13.97 324.4 top
R11  62.87,48.9 180 top
R12  99.06,32.38 180 top
R13  105.41,15.24 312.2 top
R14  91.44,57.78 270 top
R15  88.27,48.9 180 top
R16  139.06,45.73 180 top
R17  149.86,45.73 180 top
R18  149.86,32.38 180 top
R19  144.78,16.51 270 top
R20  142.24,57.78 270 top
R21  139.06,48.9 180 top
R22  113.67,45.73 180 top
R23  124.46,45.73 180 top
R24  24.77,38.42 270 top
R25  124.46,32.38 180 top
R26  129.54,16.51 268.8 top
R27  116.84,57.78 270 top
R28  113.67,48.9 180 top
R29  73.66,66.04 180 top
R30  60.96,68.58 270 top
R31  99.06,65.41 180 top
R32  86.36,68.58 270 top
R33  124.46,65.41 180 top
R34  111.76,68.58 270 top
R35  149.86,65.41 180 top
R36  137.16,68.58 270 top
R37  61.59,57.78 270 top
R38  87.63,57.78 270 top
R39  113.03,57.78 270 top
R40  138.43,57.78 270 top
R41  78.11,81.92 90 top
R42  103.5,81.92 90 top
R43  128.91,81.92 90 top
R44  153.67,81.92 90 top
R47  40.01,51.75 270 top
R48  44.45,74.3 90 top
R49  37.47,51.75 270 top
R50  38.1,74.3 90 top
R51  34.92,51.75 270 top
R52  31.75,74.3 90 top
R53  17.14,51.75 270 top
R54  25.4,74.3 90 top
R55  14.61,51.75 270 top
R56  19.05,74.3 90 top
R57  12.06,51.75 270 top
R58  12.7,74.3 90 top
R59  9.53,51.75 270 top
R60  6.35,74.3 90 top
R68  38.1,9.84 270 top
R69  33.02,9.84 270 top
R70  31.43,21.27 270 top
R71  40.64,17.46 270 top
R72  40.64,23.18 180 top
T1  68.58,52.7 270 top
T2  73.66,60.33 0 top
T3  93.98,52.7 270 top
T4  99.06,60.33 0 top
T5  144.78,52.7 270 top
T6  149.86,60.33 0 top
T7  119.38,52.7 270 top
T8  124.46,60.33 0 top
T9  71.12,79.38 270 top
T10  96.52,79.38 270 top
T11  121.92,79.38 270 top
T12  146.05,79.38 270 top
U1  13.97,26.35 270 top
U6  35.56,16.19 270 top
U$4  35.56,37.78 90 top
X1  25.4,4.13 0 top
X2  129.54,4.45 0 top
X3  25.4,81.92 180 top

### Tracks (layer width: path | path; a pad name or v marks a point on that pad's centre or on a via)
24VIN
  Top 2.184: X1.1 3.81,6.4 | 3.81,6.4 F1.1 | X1.2 6.31,6.4 3.81,6.4
+3V3  (via drill 0.6)
  Top 0.254: U$4.24 41.38,40.53 C30.1 | 31.75,41.93 31.96,41.93 | U$4.9 36.81,32.19 38.1,30.8 C29.1
  Top 0.305: 31.96,41.93 U$4.36 | U$4.48 30.27,35.03 29.43,34.19 C28.1
  Top 0.406: 77.47,84.45 78.11,83.82
  Top 0.61: C27.1 31.96,41.93 | R2.2 35.24,26.35 | C6.1 37.47,13.02 U6.8 37.47,15.56 36.83,16.19 37.25,16.61 R71.2 42.33,16.61 43.18,17.46 43.18,22.54 42.55,23.18 R72.1 | C29.1 38.52,30.38 39.37,29.53 39.37,26.35 | 31.75,26.35 31.75,32.7 31.11,33.34 C28.1 | 24.13,49.85 v24.13,50.48 | v25.4,41.59 31.41,41.59 31.75,41.93
  Top 0.813: 12.06,49.85 9.53,49.85 R59.2 | 12.06,49.85 14.61,49.85 | 14.61,49.85 17.14,49.85 | 17.14,49.85 24.13,49.85 34.92,49.85 | 34.92,49.85 37.47,49.85 | 37.47,49.85 40.01,49.85 | 40.01,49.85 41.27,49.85 | 41.27,49.85 41.49,49.85 R7.2 | R47.2 40.01,49.85 | R49.2 37.47,49.85 | R51.2 34.92,49.85 | R57.2 12.06,49.85 | R55.2 14.61,49.85 | R53.2 17.14,49.85 | C30.1 42.97,48.16 41.27,49.85
  Top 1.016: R44.2 153.67,84.45 | R43.2 128.91,83.82 128.27,84.45 | R42.2 103.5,83.82 102.87,84.45 | R41.2 78.11,83.82
  Top 1.676: U1.PAD 13.97,31.43 11.43,33.97 8.26,33.97 6.35,35.88 6.35,47.94 8.26,49.85 9.53,49.85 | 36.83,16.19 19.18,16.19 17.78,17.46 17.78,19.5 17.14,20.13 C1.1 U1.PAD | K5.1 U1.PAD
  Top 2.184: 153.67,84.45 128.27,84.45 102.87,84.45 77.47,84.45 57.15,84.45 53.66,80.96 53.66,32.27 47.11,26.35 39.37,26.35 35.24,26.35 31.75,26.35 U1.PAD
  Bottom 0.61: v24.13,50.48 24.13,42.86 v25.4,41.59
ADC1_DIM1  (via drill 0.6)
  Top 0.61: Q1.4 73.66,37.47 v73.66,43.18 | v73.66,68.58 IC1.2
  Top 1.676: 69.81,35.45 Q1.4
  Top 1.93: R6.2 69.81,35.45
  Bottom 0.61: v73.66,43.18 77.47,43.18 77.47,68.58 v73.66,68.58
ADC1_DIM2  (via drill 0.6)
  Top 0.61: Q2.4 99.06,37.47 v99.06,42.55 | v99.06,68.58 IC3.2
  Top 1.93: Q2.4 95.21,34.84 R12.2
  Bottom 0.61: v99.06,42.55 102.87,42.55 102.87,68.58 v99.06,68.58
ADC1_DIM3  (via drill 0.6)
  Top 0.406: v124.46,68.57 v124.46,68.58 | v124.46,43.18 124.46,37.47 Q5.4
  Top 0.61: IC5.2 v124.46,68.57
  Top 1.93: Q5.4 120.61,34.84 R25.2
  Bottom 0.61: v124.46,68.58 128.27,68.58 128.27,43.18 v124.46,43.18
ADC1_DIM4  (via drill 0.6)
  Top 0.406: IC7.2
  Top 0.61: Q4.4 149.86,37.47 v149.86,43.18 | IC7.2 v149.86,68.58
  Top 1.93: Q4.4 146.01,34.84 R18.2
  Bottom 0.61: v149.86,43.18 153.03,43.18 153.03,68.58 v149.86,68.58
ADC2_DIM1  (via drill 0.6)
  Top 0.406: 71.12,45.73 R3.2
  Top 0.61: 71.12,45.73 v71.12,41.91 | v73.66,69.85 IC1.3
  Top 0.813: R1.1 71.12,45.73 R3.2
  Bottom 0.61: v71.12,41.91 78.74,41.91 78.74,69.85 v73.66,69.85
ADC2_DIM2  (via drill 0.6)
  Top 0.61: R5.2 96.52,45.09 v96.52,41.27 | v99.06,69.85 IC3.3
  Top 0.813: R4.1 R5.2
  Bottom 0.61: v96.52,41.27 104.14,41.27 104.14,69.85 v99.06,69.85
ADC2_DIM3  (via drill 0.6)
  Top 0.61: R23.2 121.92,45.09 v121.92,41.91 | IC5.3 v124.46,69.85
  Top 0.813: R22.1 R23.2
  Bottom 0.406: 129.54,69.85 129.54,69.22
  Bottom 0.61: v121.92,41.91 129.54,41.91 129.54,69.22 | v124.46,69.85 129.54,69.85
ADC2_DIM4  (via drill 0.6)
  Top 0.406: IC7.3
  Top 0.61: R17.2 147.32,45.09 v147.32,41.91 | IC7.3 v149.86,69.85
  Top 0.813: R16.1 R17.2
  Bottom 0.61: v147.32,41.91 154.31,41.91 154.31,69.85 v149.86,69.85
CTRL1
  Top 0.406: R30.1 60.96,69.85
  Top 0.813: OK3.4 78.11,74.3 62.23,74.3 60.96,73.03 60.96,69.85 IC1.6
CTRL2
  Top 0.406: IC3.6 86.36,69.85 86.36,70.48
  Top 1.016: OK4.4 103.5,74.3 86.36,74.3 86.36,70.48 R32.1
CTRL3
  Top 0.406: IC5.6 111.76,69.85 111.76,70.48
  Top 1.016: OK5.4 128.91,74.3 111.76,74.3 111.76,70.48 R34.1
CTRL4
  Top 0.406: IC7.6 137.16,69.85
  Top 1.016: OK6.4 153.67,74.3 137.16,74.3 137.16,69.85 R36.1
DI1
  Top 1.016: R8.2 49.95,75.14 X3.2
DI2
  Top 1.016: R48.2 44.23,75.78 X3.3
DI3
  Top 1.016: R50.2 38.1,76.83 X3.4
DI4
  Top 1.016: R52.2 31.75,78.1 X3.5
DI5
  Top 1.016: R54.2 25.4,79.37 X3.6
DI6
  Top 1.016: R56.2 19.05,80.64 X3.7
DI7
  Top 1.016: R58.2 12.7,81.23 X3.8
DI8
  Top 1.016: R60.2 6.35,80.6 X3.9
DIM1_GND  (via drill 0.6)
  Top 0.406: v78.74,30.48 78.74,32.38 | OK3.3 75.56,71.14
  Top 0.61: 76.2,69.85 75.56,71.14
  Top 0.813: 76.2,69.85 75.56,71.14 71.73,71.14 IC1.4 | C9.2 67.31,64.77 67.31,64.14 67.31,63.5 | 67.31,63.5 76.2,63.5 76.2,64.14 | D42.A 67.31,62.23 67.31,63.5
  Top 1.93: D1.A v62.23,30.48
  Bottom 1.93: v62.23,30.48 v78.74,30.48
  pour Top: 74.93,70.48 74.93,27.3 79.38,27.3 79.38,70.48
DIM1_VDD
  Top 0.61: D22.A 60.96,52.7
  Top 1.676: D21.C 72.39,28.57
  Top 1.93: D21.C D2.C 67.31,31.34 63.18,35.24 63.18,35.19 Q1.3
  pour Top (rank 2): 59.69,33.66 63.5,33.66 63.5,37.47 60.96,37.47 60.96,53.98 59.69,53.98
DIM2_GND  (via drill 0.6)
  Top 0.406: OK4.3 100.97,71.11
  Top 0.813: IC3.4 100.97,71.11 100.97,70.48
  Top 1.016: D43.A 92.71,62.23 92.71,63.5 | 92.71,63.5 101.6,63.5 101.6,64.14 | C3.2 92.71,64.77 92.71,64.14 92.71,63.5
  Top 1.93: D24.A v87.63,30.48
  Top 2.54: v102.87,30.48 102.87,33.66
  Bottom 1.93: v87.63,30.48 v102.87,30.48
  pour Top: 100.33,70.48 100.33,27.3 104.78,27.3 104.78,70.48
DIM2_VDD
  Top 1.93: D27.C D25.C 92.71,31.11 88.64,35.19 Q2.3
  pour Top (rank 2): 85.09,33.66 88.9,33.66 88.9,37.47 86.36,37.47 86.36,53.98 85.09,53.98
DIM3_GND  (via drill 0.6)
  Top 0.406: OK5.3 126.36,71.11
  Top 0.813: IC5.4 126.36,71.11 126.36,70.48 | D44.A 118.11,62.23 118.11,63.5 | 118.11,63.5 127,63.5 127,62.87 | C7.2 118.11,64.77 118.11,63.5
  Top 1.93: D36.A v113.03,30.48
  Top 2.54: v128.27,30.48 128.27,32.38
  Bottom 1.93: v113.03,30.48 v128.27,30.48
  pour Top: 125.73,70.48 125.73,27.3 130.18,27.3 130.18,70.48
DIM3_VDD
  Top 1.93: D39.C D37.C 118.11,31.11 114.04,35.19 Q5.3
  pour Top (rank 2): 110.49,33.66 113.98,33.66 113.98,37.47 111.76,37.47 111.76,53.98 110.49,53.98
DIM4_GND  (via drill 0.6)
  Top 0.406: OK6.3 151.13,71.11
  Top 0.813: IC7.4 151.13,71.11 151.76,71.11 151.76,70.48 | D45.A 143.51,62.23 143.51,63.5 | 143.51,63.5 151.13,63.5 151.13,64.14 | C8.2 143.51,64.77 143.51,63.5
  Top 1.93: D30.A v138.43,30.48
  Top 2.54: v153.67,30.48 153.67,32.38
  Bottom 1.93: v138.43,30.48 v153.67,30.48
  pour Top: 151.13,70.48 151.13,27.3 155.57,27.94 155.57,71.12
DIM4_VDD
  Top 0.305: 143.51,28.57 D31.C
  Top 1.93: D33.C D31.C 143.51,31.11 139.44,35.19 Q4.3
  Top 2.54: D31.C 143.51,28.57
  pour Top (rank 2): 135.89,33.66 139.7,33.66 139.7,37.47 137.16,37.47 137.16,53.98 135.89,53.98
DIMMER1
  Top 1.422: D20.C 77.47,22.23
  Top 1.93: D21.A D20.C
  Top 2.184: R10.2 85.12,18.41 81.28,18.41 77.47,22.23
  Bottom 1.422: 88.37,15.13 R10.2
  Bottom 2.184: X2.2 111.76,4.47 111.76,6.35 108.59,8.89 95.25,8.89 88.37,15.13
DIMMER2
  Top 2.184: X2.4 121.9,8.91 115.57,14.61 109.55,14.61 R13.2 102.87,21.76 D26.C
  Top 2.54: D27.A D26.C
DIMMER3
  Top 1.422: X2.6 132.05,5.11
  Top 1.93: D39.A D38.C
  Top 2.184: 132.05,5.11 R26.2 132.05,19.7 D38.C
DIMMER4
  Top 1.93: D33.A D32.C
  Top 2.184: X2.8 142.22,10.14 R19.2 148.59,16.51 D33.A
DIR
  Top 0.254: U6.3 34.92,19.37
  Top 0.61: U6.2 36.2,21.27 | 36.2,21.27 36.2,22.71 Q11.3 R72.2 | U6.3 34.92,20 36.2,21.27
GATE_DIM1  (via drill 0.6)
  Top 0.406: 73.66,61.59 T2.3
  Top 0.61: Q1.1 62.23,39.74 v62.23,42.55
  Top 0.813: T2.3 68.58,61.42 v68.58,59.05 68.58,59.19 R9.1
  Bottom 0.61: v62.23,42.55 68.58,42.55 v68.58,59.05
GATE_DIM2  (via drill 0.6)
  Top 0.61: Q2.1 87.63,39.74 v87.63,42.55 | v93.98,59.05 91.44,59.05 R14.1
  Top 1.016: T4.3 93.98,61.42 v93.98,59.05
  Bottom 0.61: v87.63,42.55 93.98,42.55 v93.98,59.05
GATE_DIM3  (via drill 0.6)
  Top 0.61: Q5.1 113.03,39.74 v113.03,42.55 | v119.38,59.05 116.84,59.05 R27.1
  Top 0.813: T8.3 119.38,61.42 v119.38,59.05
  Bottom 0.61: v113.03,42.55 118.11,42.55 119.38,42.55 v119.38,59.05
GATE_DIM4  (via drill 0.6)
  Top 0.61: Q4.1 arc-90 138.43,40.02 v138.43,42.55
  Top 1.016: R20.1 144.78,59.19 | 144.78,59.19 v144.78,59.05 | T6.3 144.78,61.42 144.78,59.19
  Bottom 0.61: v138.43,42.55 144.78,42.55 v144.78,59.05
GND  (via drill 0.6)
  Top 0.305: R24.1 25.3,39.27 v26.04,39.37 | U$4.23 46.38,40.03 v46.99,40.64 | U$4.47 26.64,35.53 v25.4,34.29 | U$4.8 36.31,31.64 36.83,31.11 v36.83,28.57 36.93,28.68 C29.2 | U$4.35 33.31,43.21 32.38,44.13 27.94,44.13 v27.3,43.5 27.94,42.86 C27.2
  Top 0.406: U6.5 33.66,13.34 33.02,12.7 v31.75,12.7 | C30.2 45.4,42.23 v46.99,40.64 | C28.2 26.35,33.34 v25.4,34.29
  Top 0.61: T10.2 93.03,78.42 v92.71,78.74 | T11.2 118.42,78.42 v118.11,78.74 | T9.2 67.62,78.42 v67.31,78.74 | OK2.2 v15.88,59.69 OK2.15 | OK2.6 v10.79,59.69 OK2.11 | OK2.4 v13.34,59.69 OK2.13 | OK2.8 v8.26,59.69 OK2.9 | OK1.8 v33.66,59.69 OK1.9 | OK1.6 v36.2,59.69 OK1.11 | OK1.4 v38.73,59.69 OK1.13 | OK1.2 v41.27,59.69 OK1.15 | C6.2 v44.45,13.02
  Top 1.016: T12.2 141.92,78.42 v141.6,78.74 | D17.A v9.53,73.03 | D15.A v15.88,73.03 | D13.A v22.23,73.03 | D11.A v28.57,73.03 | D9.A v34.92,73.03 | D7.A v41.27,73.03 | D4.A v47.62,73.03 | D19.A v3.17,73.03
  Top 1.27: v8.89,13.65 D5.A | U1.1 6.83,28.89 v3.17,28.89 2.54,28.26 C13.2
  Top 1.676: C1.2 v13.97,15.56
  Bottom 0.305: v36.83,28.57 36.83,27.94 | v27.3,43.5 26.99,43.5 26.67,43.18
  Bottom 0.406: v31.75,12.7 30.48,12.7 | v46.99,40.64 48.26,40.64 | v25.4,34.29 25.4,35.56
  Bottom 0.61: v92.71,78.74 92.08,78.74 91.44,79.38
  Bottom 2.184: v141.6,78.74 v118.11,78.74 v92.71,78.74 v67.31,78.74 56.52,78.74 53.66,76.2 53.66,46.35 48.9,42.23
  pour Bottom (isolate 0.406, rank 6): -2.54,88.9 50.8,88.9 50.8,-15.24 -2.54,-15.24
IN1  (via drill 0.6)
  Top 0.254: U$4.45 25.38,36.53 v21.59,36.51 | v43.18,53.98 42.55,53.02
  Top 0.813: R7.1 42.55,53.02 OK1.16
  Bottom 0.254: v21.59,36.51 21.59,53.02 25.72,57.15 40.64,57.15 43.18,54.61 v43.18,53.98
IN2  (via drill 0.6)
  Top 0.254: U$4.46 23.34,36.03 v22.86,35.24 | v40.64,53.98 40.01,53.02
  Top 0.813: R47.1 40.01,53.02 OK1.14
  Bottom 0.254: v22.86,35.24 22.86,39.05 22.86,52.39 26.99,56.52 38.1,56.52 v40.64,53.98
IN3  (via drill 0.6)
  Top 0.254: v38.1,53.98 37.47,53.02
  Top 0.305: U$4.21 41.3,39.03 41.91,38.42 v41.91,37.78
  Top 0.813: R49.1 37.47,53.02 OK1.12
  Bottom 0.254: v41.91,37.78 34.29,37.78 31.75,40.32 31.75,49.21 31.75,50.48 33.66,52.39 36.51,52.39 v38.1,53.98
IN4  (via drill 0.6)
  Top 0.254: v35.56,53.98 34.92,53.02
  Top 0.305: U$4.22 42.7,39.53 43.18,39.05 v43.18,36.83
  Top 0.813: R51.1 34.92,53.02 OK1.10
  Bottom 0.254: v43.18,36.83 33.97,36.83 30.8,40.01 30.8,50.48 34.29,53.98 v35.56,53.98
IN5  (via drill 0.6)
  Top 0.254: R53.1 17.14,53.02 v17.78,54.29 | v17.78,48.58 37.47,48.58 38.31,47.73 U$4.25
  Top 0.61: OK2.16 17.14,53.02 R53.1
  Bottom 0.254: v17.78,54.29 v17.78,48.58
IN6  (via drill 0.6)
  Top 0.254: R55.1 14.61,53.02 v15.24,54.29 | v15.24,47.94 16.19,46.99 18.73,46.99 19.68,47.94 37.15,47.94 37.81,47.28 U$4.26
  Top 0.61: OK2.14 14.61,53.02 R55.1
  Bottom 0.254: v15.24,54.29 v15.24,47.94
IN7  (via drill 0.6)
  Top 0.254: R57.1 12.06,53.02 v12.7,54.29 | v12.7,47.94 14.29,46.35 19.05,46.35 20,47.31 36.83,47.31 37.31,46.83 U$4.27
  Top 0.61: OK2.12 R57.1
  Bottom 0.254: v12.7,54.29 v12.7,47.94
IN8  (via drill 0.6)
  Top 0.254: 9.53,53.02 v10.16,54.29 | v10.16,46.67 11.43,45.72 19.37,45.72 20.32,46.67 36.58,46.67 36.83,46.42 36.83,44.13 36.83,41.59
  Top 0.305: U$4.28 36.81,41.61 36.83,41.59
  Top 0.406: R59.1 9.53,53.02
  Top 0.61: OK2.10 R59.1 9.53,52.39
  Bottom 0.254: v10.16,54.29 v10.16,46.67
N$1
  Top 0.406: IC7.8 137.16,67.31 137.16,67.63
  Top 1.016: R40.1 137.16,59.19 137.16,61.59 | 137.16,61.59 137.16,65.41 | 137.16,65.41 137.16,67.63 R36.2 | C8.1 137.16,64.77 137.16,65.41 | D45.C 137.16,62.23 137.16,61.59
N$2
  Top 0.813: R15.1 D29.C 97.61,51.71 T3.3
N$3
  Top 0.813: D28.C 92.94,52.7 T3.1
N$4
  Top 0.813: T1.1 65.68,52.7 D22.C
N$5
  Top 0.406: D23.C 72.39,48.9 D23.C
  Top 0.813: R11.1 D23.C 72.21,51.72 T1.3
N$6
  Top 0.406: IC1.8 60.96,67.31 R30.2
  Top 0.813: R37.1 60.96,59.82 | C9.1 60.96,64.77 60.96,65.41
  Top 1.016: 60.96,59.82 60.96,61.59 | 60.96,61.59 60.96,62.23 | 60.96,62.23 60.96,65.41 R30.2 | D42.C 60.96,62.23 | 60.96,62.23 60.96,61.59
N$7
  Top 0.406: IC3.8 86.36,67.31 R32.2
  Top 1.016: R32.2 86.36,66.67 86.36,64.14 | 86.36,64.14 86.36,61.59 | 86.36,61.59 86.36,59.05 87.63,59.05 R38.1 | C3.1 86.36,64.77 86.36,64.14 | D43.C 86.36,62.23 86.36,61.59
N$8
  Top 0.813: R8.1 D3.C
N$9
  Top 0.813: R21.1 D35.C 148.41,51.71 T5.3
N$10
  Top 0.61: OK1.1 42.55,64.14 43.18,64.77 46.99,64.77 47.62,65.41 47.62,66.14 48.26,66.78
  Top 0.813: D4.C 48.26,66.78 50.8,66.78 D3.A
N$11
  Top 0.813: D34.C 143.76,52.7 T5.1
N$12
  Top 0.406: IC5.8 111.76,67.31 111.76,67.63
  Top 1.016: R39.1 111.76,59.19 111.76,61.59 | 111.76,61.59 111.76,64.14 | 111.76,64.14 111.76,67.63 R34.2 | C7.1 111.76,64.77 111.76,64.14 | D44.C 111.76,62.23 111.76,61.59
N$13
  Top 0.813: R28.1 D41.C 123.01,51.71 T7.3
N$14
  Top 0.813: D40.C 118.36,52.7 T7.1
N$15
  Top 0.813: R37.2 R9.2 72.26,56.38 C10.1 72.26,53.65 T1.2
N$16
  Top 1.016: OK3.1 R41.1
N$17
  Top 0.813: R38.2 R14.2 96.89,56.38 C4.1 97.03,53.65 T3.2
N$18
  Top 1.016: T9.3 75.25,79.38 OK3.2
N$19
  Top 1.016: OK4.1 R42.1
N$20
  Top 0.813: 116.84,56.52 C5.1 122.42,53.65 T7.2 | 116.84,56.52 R27.2 | 116.84,56.52 113.03,56.52 R39.2
N$21
  Top 0.813: R48.1 D6.C
N$22
  Top 1.016: T10.3 100.66,79.38 OK4.2
N$23
  Top 0.61: OK1.3 40.01,64.14 41.27,65.41 D7.C
  Top 0.813: D7.C 44.45,66.78 D6.A
N$24
  Top 1.016: OK5.1 R43.1
N$25
  Top 0.813: T5.2 147.82,53.65 C11.1 147.82,56.38 R20.2 R40.2
N$26
  Top 0.406: IC5.1 123.61,67.31 R33.2
N$27
  Top 1.016: T11.3 126.06,79.38 OK5.2
N$28
  Top 1.016: OK6.1 R44.1
N$29
  Top 1.016: T12.3 150.82,79.38 OK6.2
N$30
  Bottom 2.184: X2.9 X2.10
N$33
  Top 0.406: IC1.1 72.39,67.31 72.39,66.67 R29.2
N$34
  Top 0.406: IC3.1 98.21,67.31 R31.2
N$35
  Top 0.406: IC7.1 149.01,67.31 R35.2
N$38
  Top 0.813: R50.1 D8.C
N$39
  Top 0.61: OK1.5 37.47,64.14 38.1,64.77 D8.A
  Top 0.813: D9.C 38.1,66.78 D8.A
N$40
  Top 0.813: R52.1 D10.C
N$41
  Top 0.61: OK1.7 34.92,63.7 D10.A
  Top 0.813: D11.C 31.75,66.78 D10.A
N$42
  Top 0.813: R54.1 D12.C
N$45
  Top 0.61: OK2.1 17.14,64.14 17.78,64.77 20.95,64.77 22.23,66.04 D13.C
  Top 0.813: D13.C 25.4,66.78 D12.A
N$47
  Top 0.813: R56.1 D14.C
N$49
  Top 0.61: OK2.3 14.61,64.14 15.88,65.41 D15.C
  Top 0.813: D15.C 19.05,66.78 D14.A
N$51
  Top 0.813: R58.1 D16.C
N$53
  Top 0.61: OK2.5 12.06,64.14 12.7,64.77 D16.A
  Top 0.813: D17.C 12.7,66.78 D16.A
N$54
  Top 0.813: R60.1 D18.C
N$55
  Top 0.61: OK2.7 9.53,63.7 D18.A
  Top 0.813: D19.C 6.35,66.78 D18.A
N$63
  Top 0.61: U6.7 36.2,11.75 36.83,11.11 37.68,11.11 R68.1
N$64
  Top 0.61: U6.6 34.92,11.75 34.29,11.11 33.44,11.11 R69.1
N$65
  Top 0.61: Q11.1 32.06,24.13 31.43,23.5 R70.1
PHASE1
  Top 1.93: D1.C D2.A
  Top 2.184: X2.1 91.84,4.47 R10.1 78.15,12.64 D2.A
PHASE2
  Top 1.422: R13.1 100.8,15.88
  Top 2.184: X2.3 116.84,4.47 116.84,6.35 113.03,10.16 107.62,10.16 R13.1 | 100.8,15.88 99.06,15.88 92.71,22.23 D25.A
  Top 2.54: D24.C D25.A
PHASE3
  Top 1.422: X2.5 127,5.13 | 127,18.41 127,17.86 R26.1
  Top 1.93: D36.C D37.A
  Top 2.184: 127,5.13 127,18.41 | R26.1 121.23,17.83 118.11,20.95 D37.A
PHASE4
  Top 1.93: D30.C D31.A
  Top 2.184: X2.7 137.14,12.68 R19.1 143.51,19.05 D31.A
PWM1  (via drill 0.6)
  Top 0.305: T9.1 68.9,80.33 v67.94,81.28 | U$4.29 36.31,40.84 36.83,40.32 37.47,39.69 v38.1,39.05
  Bottom 0.305: v67.94,81.28 54.93,81.28 51.44,77.79 51.44,47.31 43.18,39.05 v38.1,39.05
PWM2  (via drill 0.6)
  Top 0.305: T10.1 94.3,80.33 v92.71,81.92 | U$4.30 35.81,40.89 v35.24,40.32
  Bottom 0.305: v92.71,81.92 92.08,82.55 55.24,82.55 50.8,78.11 50.8,47.94 43.18,40.32 v35.24,40.32
PWM3  (via drill 0.6)
  Top 0.305: T11.1 119.7,80.33 v118.11,81.92 | U$4.31 35.31,43.56 v35.88,44.13
  Bottom 0.305: v118.11,81.92 116.2,83.82 55.56,83.82 50.16,78.42 50.16,48.58 45.72,44.13 v35.88,44.13
PWM4  (via drill 0.6)
  Top 0.305: T12.1 143.83,80.33 v142.24,81.92 | U$4.32 34.81,44.65 v33.97,45.4
  Bottom 0.305: v142.24,81.92 139.06,85.09 55.88,85.09 49.53,78.74 49.53,49.21 45.72,45.4 v33.97,45.4
PWM_DIM1  (via drill 0.6)
  Top 0.61: T2.1 71.12,59.23 v71.12,59.05 | v62.87,72.07 62.87,71.12 IC1.5
  Bottom 0.61: v71.12,59.05 71.12,70.48 69.53,72.07 v62.87,72.07
PWM_DIM2  (via drill 0.6)
  Top 0.61: T4.1 98.11,59.05 v96.52,59.05 | v88.27,72.07 88.27,71.12 IC3.5
  Bottom 0.61: v96.52,59.05 96.52,70.48 94.93,72.07 v88.27,72.07
PWM_DIM3  (via drill 0.6)
  Top 0.406: T8.1 123.51,59.05 v120.65,59.05 | v113.35,72.07 113.35,71.12 IC5.5
  Bottom 0.406: v120.65,59.05 120.65,70.48 119.06,72.07 v113.35,72.07
PWM_DIM4  (via drill 0.6)
  Top 0.61: T6.1 148.74,59.05 v147.32,59.05 | v139.06,72.07 139.06,71.12 IC7.5
  Bottom 0.61: v147.32,59.05 147.32,69.22 144.46,72.07 v139.06,72.07
RS485_A
  Top 0.813: X1.7 33,8.97 R69.2
RS485_B
  Top 0.813: X1.8 38.08,8.97 R68.2
RX  (via drill 0.6)
  Top 0.254: R71.1 37.71,18.31 U6.1
  Top 0.305: U6.1 v37.47,21.27 | v28.57,38.1 29.14,37.53 U$4.43
  Bottom 0.305: v37.47,21.27 29.84,21.27 28.57,22.54 v28.57,38.1
SWCLK
  Top 0.305: U$4.37 20.53,40.53 19.05,39.05 19.05,35.24 K5.2
SWDIO
  Top 0.305: U$4.34 33.81,43.66 32.7,44.77 23.5,44.77 K5.4
TX  (via drill 0.6)
  Top 0.305: R70.2 28.79,20.42 v27.94,21.27 | v27.3,39.37 29.53,39.37 29.84,39.05 29.84,38.42 30.23,38.03 U$4.42
  Top 0.406: U6.4 31.43,18.52 R70.2
  Bottom 0.305: v27.94,21.27 27.3,21.91 v27.3,39.37
UC_BOOT
  Top 0.305: U$4.44 25.3,37.03 R24.2
UC_NRST  (via drill 0.6)
  Top 0.305: K5.5 16.51,40.32 16.51,33.34 17.14,32.7 24.13,32.7 26.04,30.8 v30.48,30.8 | U$4.7 35.81,30.95 R2.1 35.14,30.8 v33.66,30.8
  Bottom 0.305: v33.66,30.8 v30.48,30.8
VCC
  Top 1.27: F1.2 4.3,19.51 D5.C | 7.07,23.26 U1.2 2.81,24.05 C13.1
  Top 2.184: F1.2 7.07,23.26

### Text on the board
tDocu: Licensed under CERN OHL v.1.2 | Author Bernhard Trinnes | bernhard.trinnes@guh.guru | ARGE guh